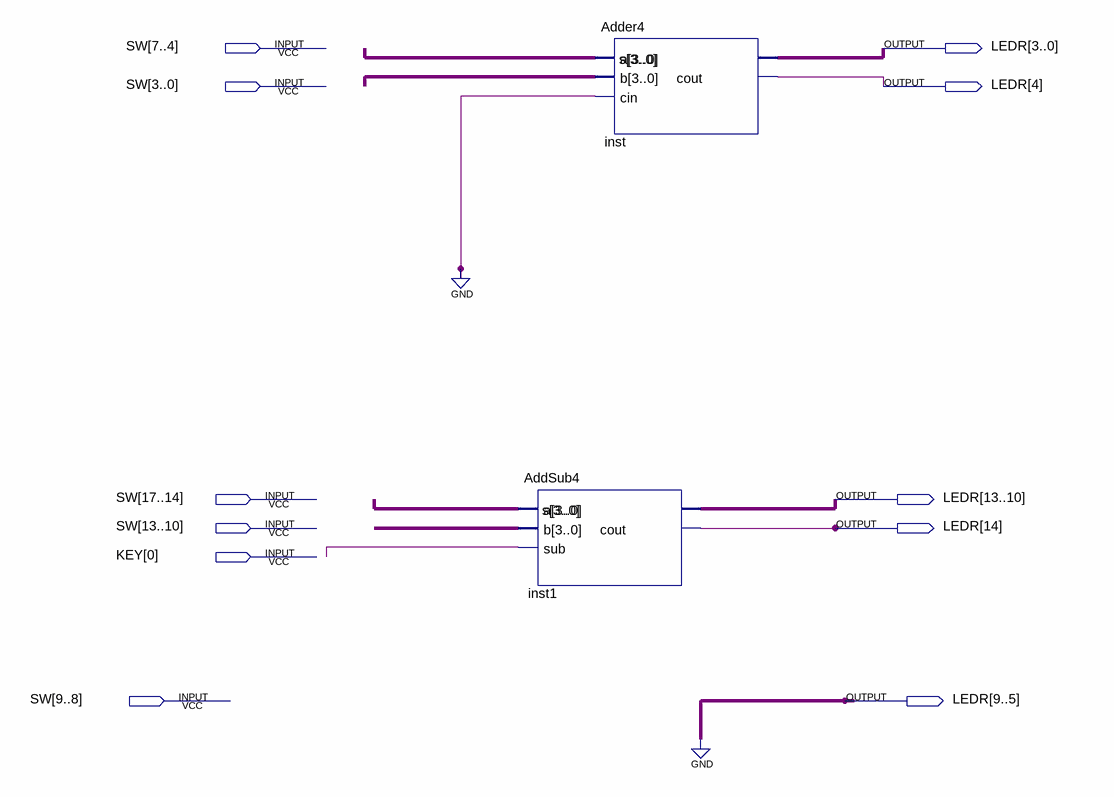
[diagram p0: schematic sheet]
// Quartus schematic AdderDemo.bdf as structural Verilog: 2 symbols, 11 pins
module AdderDemo (
  input  [17:0] SW,
  input  [0:0] KEY,
  output [14:0] LEDR
);

  wire undriven_5;
  wire [3:0] undriven, undriven_2, undriven_3, undriven_4;

  AddSub4 inst1 (.a(undriven_3), .b(undriven_4), .sub(undriven_5), .s(LEDR[13:10]), .cout(LEDR[14]));
  Adder4 inst (.a(undriven_2), .b(undriven), .cin(1'b0), .s(LEDR[3:0]), .cout(LEDR[4]));

  assign LEDR[9:5] = {5{1'b0}};
endmodule
